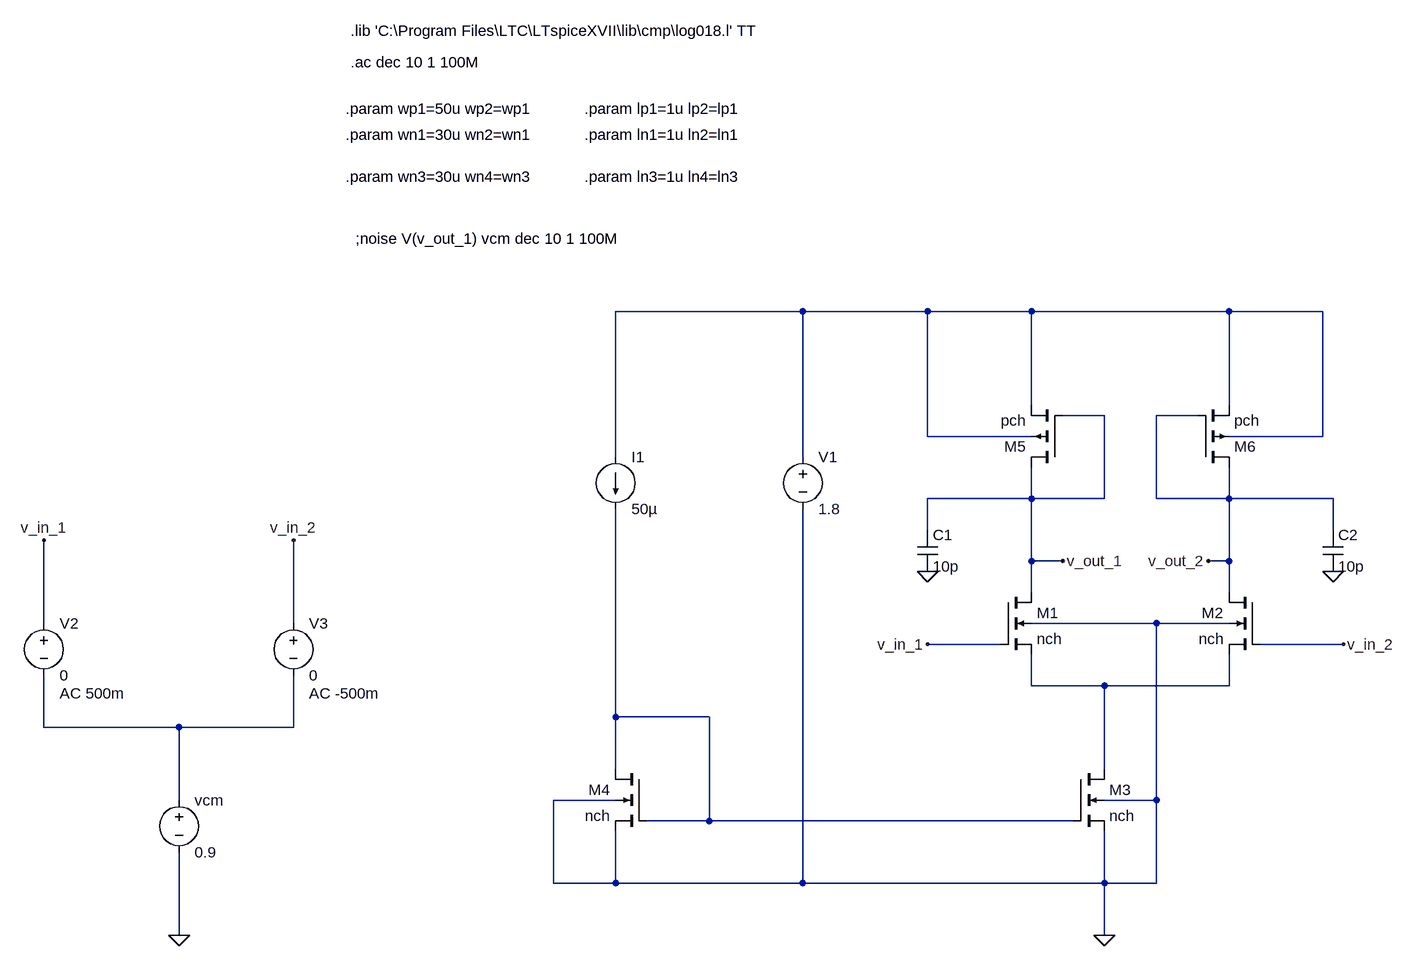
[diagram p0: schematic differential-pair-current-mirror.asc]
differential-pair-current-mirror.asc, the LTspice schematic file:
Version 4
SHEET 1 1352 1076
WIRE 352 96 64 96
WIRE 544 96 352 96
WIRE 704 96 544 96
WIRE 1008 96 704 96
WIRE 1152 96 1008 96
WIRE 704 240 704 96
WIRE 1008 240 1008 96
WIRE 816 256 752 256
WIRE 960 256 896 256
WIRE 544 288 544 96
WIRE 704 288 544 288
WIRE 1152 288 1152 96
WIRE 1152 288 1008 288
WIRE 64 320 64 96
WIRE 352 320 352 96
WIRE 704 384 704 336
WIRE 704 384 544 384
WIRE 816 384 816 256
WIRE 816 384 704 384
WIRE 896 384 896 256
WIRE 1008 384 1008 336
WIRE 1008 384 896 384
WIRE 1168 384 1008 384
WIRE 544 432 544 384
WIRE 1168 432 1168 384
WIRE 704 480 704 384
WIRE 752 480 704 480
WIRE 1008 480 1008 384
WIRE 1008 480 976 480
WIRE 704 528 704 480
WIRE 1008 528 1008 480
WIRE -816 576 -816 448
WIRE -432 576 -432 448
WIRE 896 576 704 576
WIRE 1008 576 896 576
WIRE 656 608 544 608
WIRE 1184 608 1056 608
WIRE 704 672 704 624
WIRE 816 672 704 672
WIRE 1008 672 1008 624
WIRE 1008 672 816 672
WIRE 64 720 64 400
WIRE 208 720 64 720
WIRE -816 736 -816 656
WIRE -608 736 -816 736
WIRE -432 736 -432 656
WIRE -432 736 -608 736
WIRE 64 800 64 720
WIRE 816 800 816 672
WIRE -608 848 -608 736
WIRE 64 848 -32 848
WIRE 896 848 896 576
WIRE 896 848 816 848
WIRE 208 880 208 720
WIRE 208 880 112 880
WIRE 768 880 208 880
WIRE -32 976 -32 848
WIRE 64 976 64 896
WIRE 64 976 -32 976
WIRE 352 976 352 400
WIRE 352 976 64 976
WIRE 816 976 816 896
WIRE 816 976 352 976
WIRE 896 976 896 848
WIRE 896 976 816 976
WIRE -608 1056 -608 928
WIRE 816 1056 816 976
FLAG 816 1056 0
FLAG -608 1056 0
FLAG 544 608 v_in_1
FLAG 1184 608 v_in_2
FLAG -816 448 v_in_1
FLAG -432 448 v_in_2
FLAG 752 480 v_out_1
FLAG 976 480 v_out_2
FLAG 544 496 0
FLAG 1168 496 0
SYMBOL nmos4 656 528 R0
SYMATTR InstName M1
SYMATTR Value nch
SYMATTR Value2 l=ln1 w=wn1
SYMBOL nmos4 1056 528 M0
SYMATTR InstName M2
SYMATTR Value nch
SYMATTR Value2 l=1u w=ln2
SYMBOL nmos4 768 800 R0
SYMATTR InstName M3
SYMATTR Value nch
SYMATTR Value2 l=ln3 w=wn3
SYMBOL nmos4 112 800 M0
SYMATTR InstName M4
SYMATTR Value nch
SYMATTR Value2 l=ln4 w=wn4
SYMBOL pmos4 752 336 R180
SYMATTR InstName M5
SYMATTR Value pch
SYMATTR Value2 l={lp1} w={wp1}
SYMBOL pmos4 960 336 M180
SYMATTR InstName M6
SYMATTR Value pch
SYMATTR Value2 l={lp2} w={wp2}
SYMBOL current 64 320 R0
SYMATTR InstName I1
SYMATTR Value 50µ
SYMBOL voltage 352 304 R0
WINDOW 123 0 0 Left 0
WINDOW 39 0 0 Left 0
SYMATTR InstName V1
SYMATTR Value 1.8
SYMBOL voltage -816 560 R0
WINDOW 123 24 124 Left 2
WINDOW 39 0 0 Left 0
SYMATTR Value2 AC 500m
SYMATTR InstName V2
SYMATTR Value 0
SYMBOL voltage -608 832 R0
WINDOW 123 0 0 Left 0
WINDOW 39 0 0 Left 0
SYMATTR InstName vcm
SYMATTR Value 0.9
SYMBOL voltage -432 560 R0
WINDOW 123 24 124 Left 2
WINDOW 39 0 0 Left 0
SYMATTR Value2 AC -500m
SYMATTR InstName V3
SYMATTR Value 0
SYMBOL cap 528 432 R0
SYMATTR InstName C1
SYMATTR Value 10p
SYMBOL cap 1152 432 R0
SYMATTR InstName C2
SYMATTR Value 10p
TEXT -344 -336 Left 2 !.lib 'C:\\Program Files\\LTC\\LTspiceXVII\\lib\\cmp\\log018.l' TT
TEXT -344 -288 Left 2 !.ac dec 10 1 100M
TEXT -352 -216 Left 2 !.param wp1=50u wp2=wp1
TEXT -352 -176 Left 2 !.param wn1=30u wn2=wn1
TEXT 16 -216 Left 2 !.param lp1=1u lp2=lp1
TEXT 16 -176 Left 2 !.param ln1=1u ln2=ln1
TEXT -352 -112 Left 2 !.param wn3=30u wn4=wn3
TEXT 16 -112 Left 2 !.param ln3=1u ln4=ln3
TEXT -336 -16 Left 2 !;noise V(v_out_1) vcm dec 10 1 100M

The netlist it stands for:
* differential-pair-current-mirror.asc
M1 v_out_1 v_in_1 N002 0 nch l=ln1 w=wn1
M2 v_out_2 v_in_2 N002 0 nch l=1u w=ln2
M3 N002 N003 0 0 nch l=ln3 w=wn3
M4 N003 N003 0 0 nch l=ln4 w=wn4
M5 v_out_1 v_out_1 N001 N001 pch l={lp1} w={wp1}
M6 v_out_2 v_out_2 N001 N001 pch l={lp2} w={wp2}
I1 N001 N003 50µ
V1 N001 0 1.8
V2 v_in_1 N004 0 AC 500m
vcm N004 0 0.9
V3 v_in_2 N004 0 AC -500m
C1 v_out_1 0 10p
C2 v_out_2 0 10p
.model NMOS NMOS
.model PMOS PMOS
.lib standard.mos
.lib 'C:\Program Files\LTC\LTspiceXVII\lib\cmp\log018.l' TT
.ac dec 10 1 100M
.param wp1=50u wp2=wp1
.param wn1=30u wn2=wn1
.param lp1=1u lp2=lp1
.param ln1=1u ln2=ln1
.param wn3=30u wn4=wn3
.param ln3=1u ln4=ln3
;noise V(v_out_1) vcm dec 10 1 100M
.backanno
.end